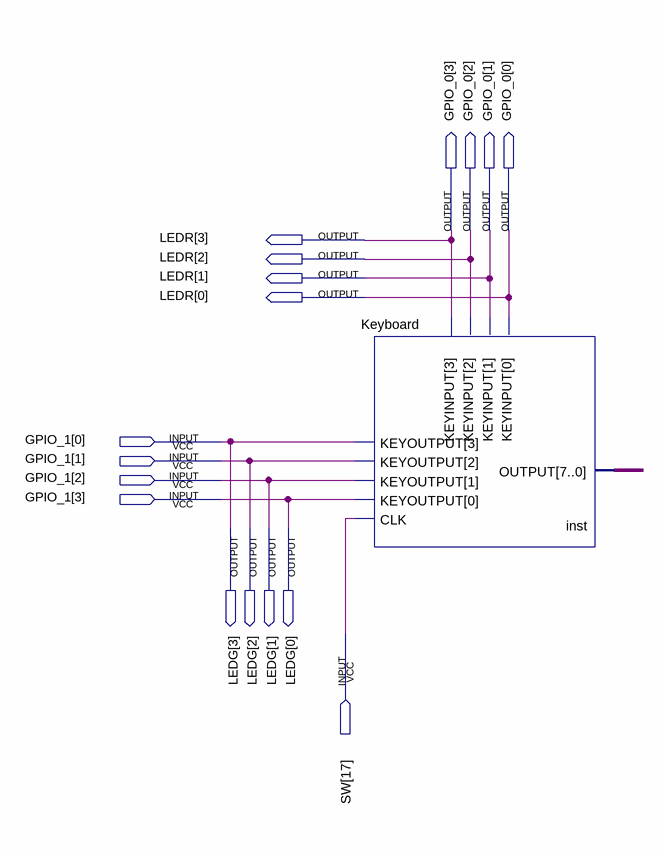
[diagram p0: schematic sheet]
// Quartus schematic test.bdf as structural Verilog: 1 symbols, 17 pins
module test (
  input  [3:0] GPIO_1,
  input  [17:17] SW,
  output [3:0] GPIO_0,
  output [3:0] LEDR,
  output [3:0] LEDG
);

  wire [7:0] inst_output;

  Keyboard inst (
    .CLK(SW[17]), .KEYOUTPUT({GPIO_1[0], GPIO_1[1], GPIO_1[2], GPIO_1[3]}), .KEYINPUT(GPIO_0),
    .OUTPUT(inst_output));

  assign LEDG = {GPIO_1[0], GPIO_1[1], GPIO_1[2], GPIO_1[3]};
  assign LEDR = GPIO_0;
endmodule
